# EAGLE schematic logmega (EAGLE 6.5.0)
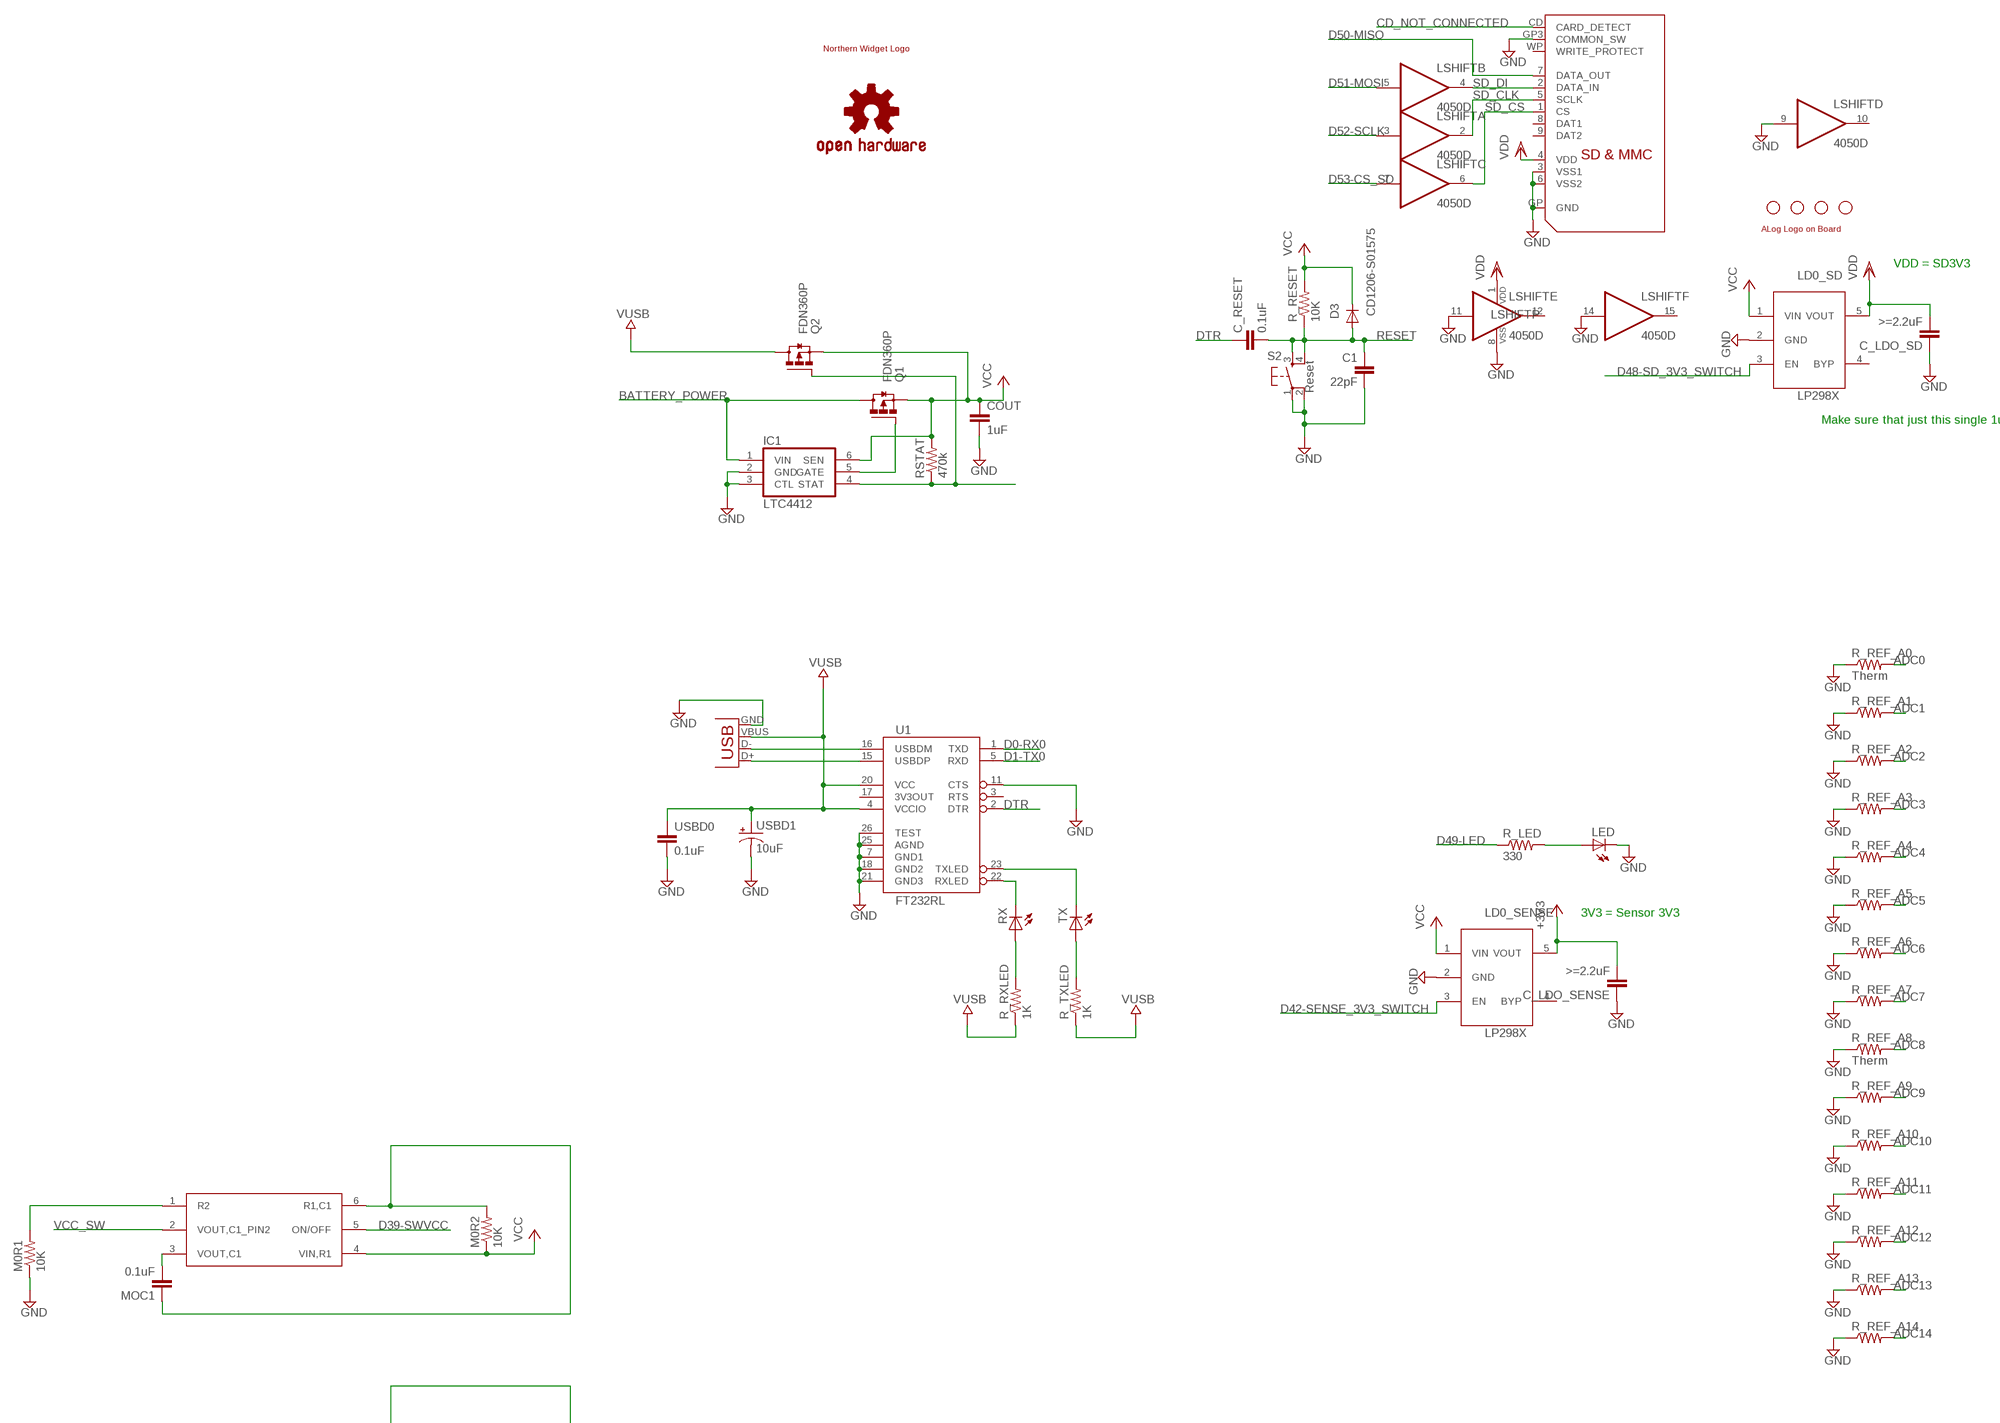
[diagram p0: schematic, sheet 1, part 1 of 3]
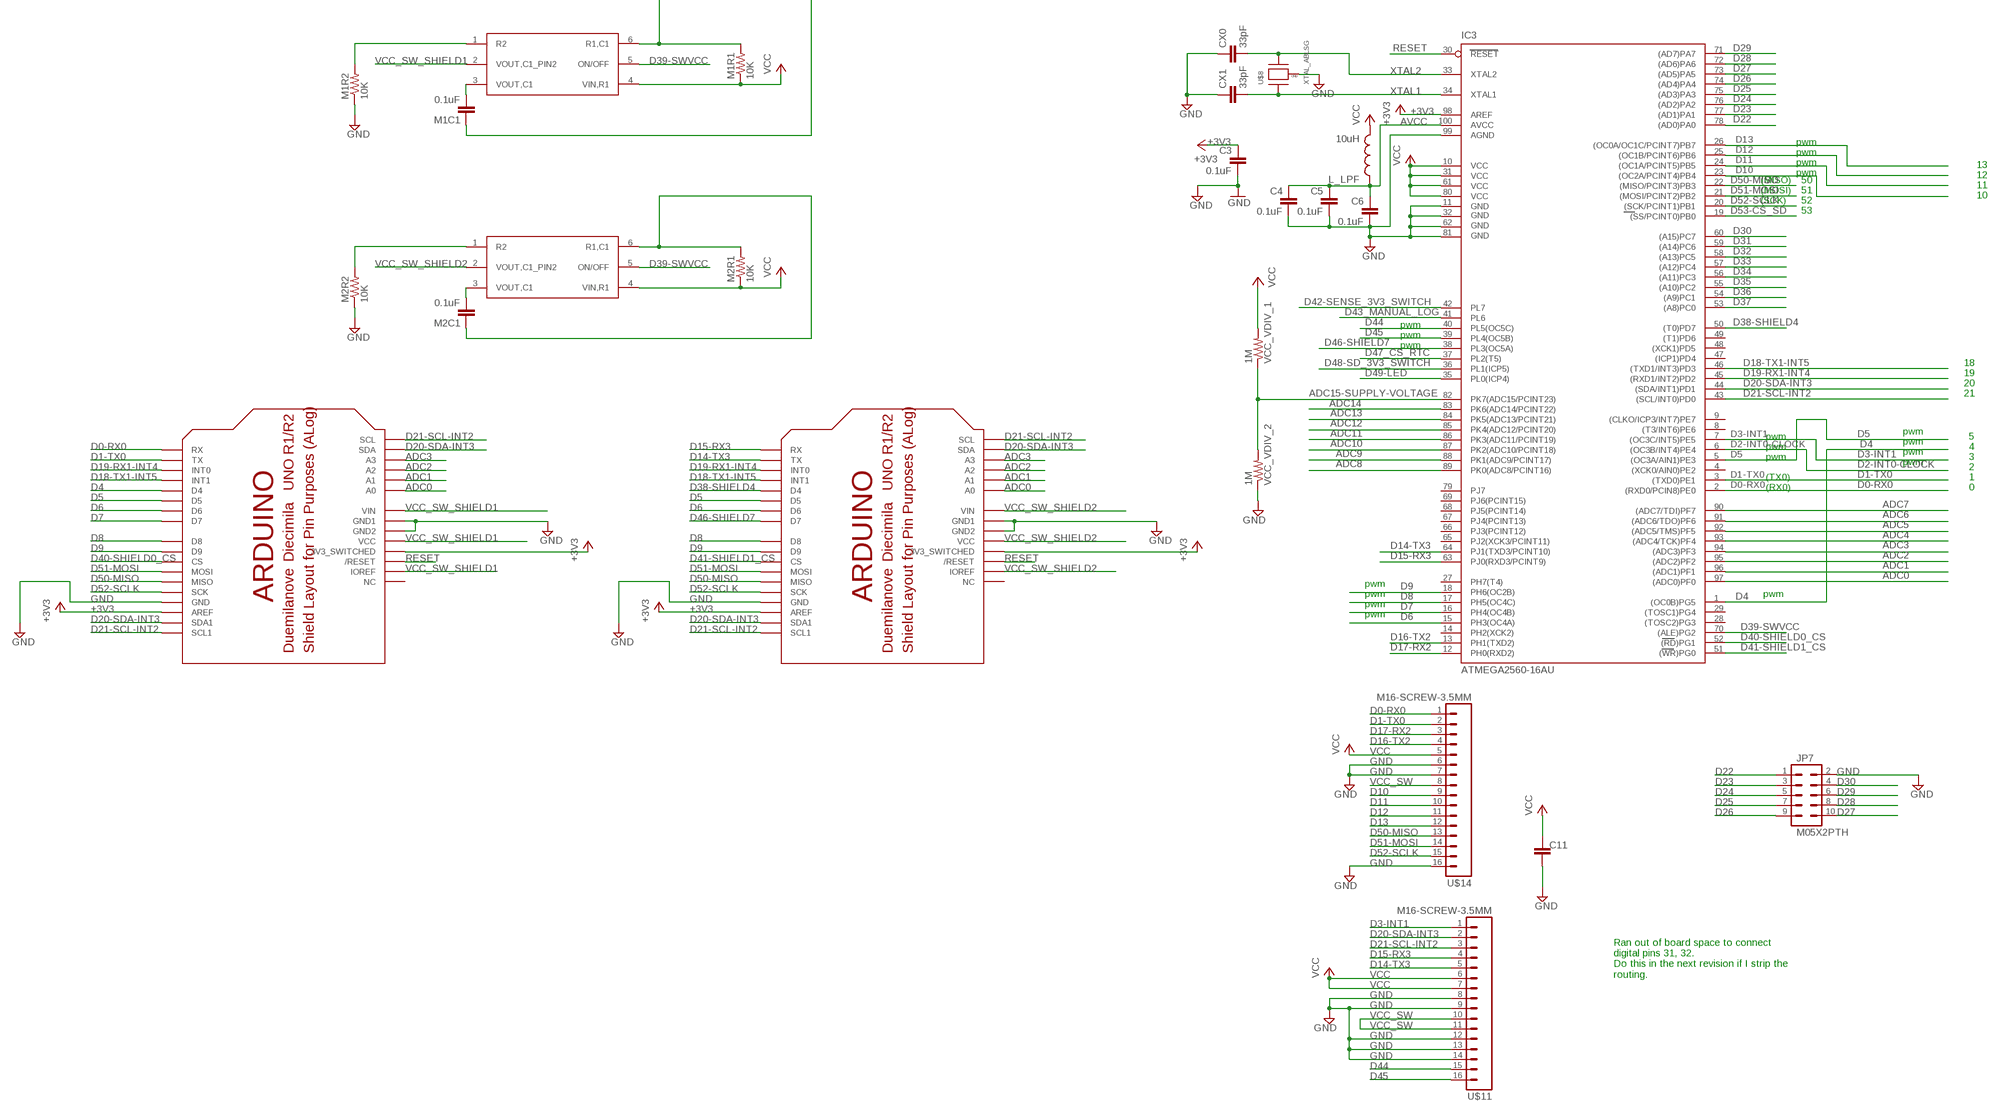
[diagram p1: schematic, sheet 1, part 2 of 3]
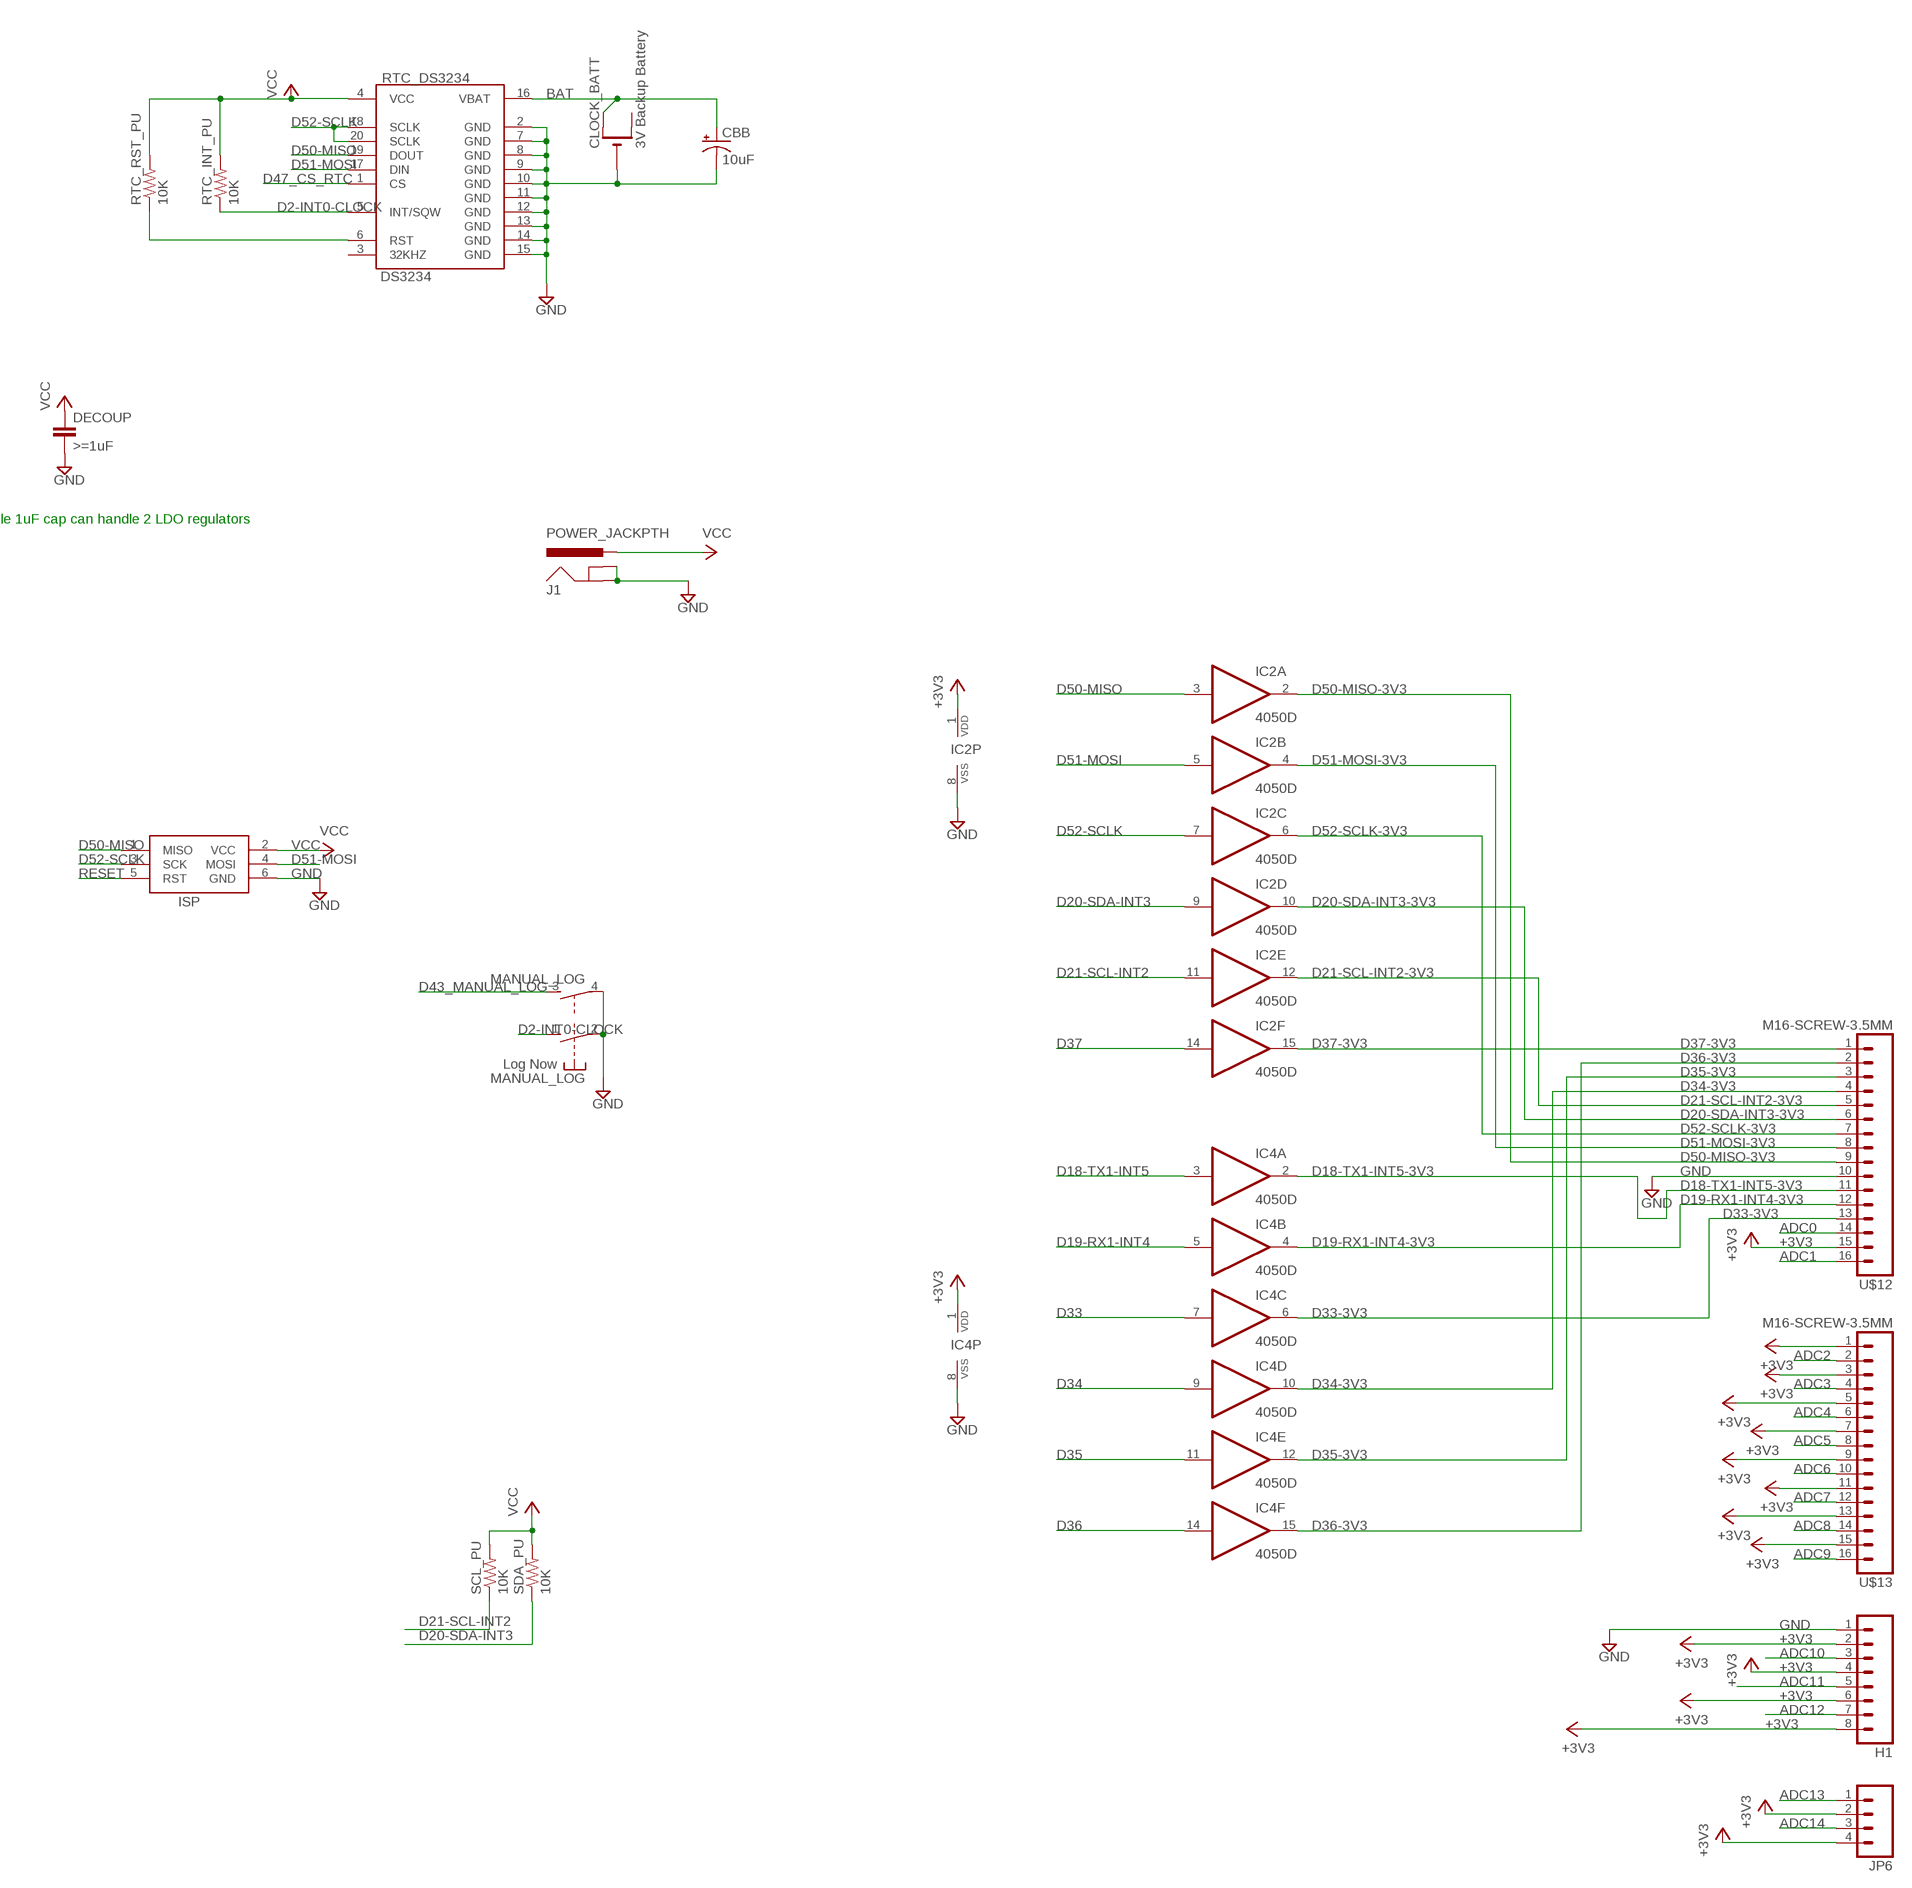
[diagram p2: schematic, sheet 1, part 3 of 3]

## Parts
C1  22pF  C-EU0603-RND  [C0603-ROUND]
C3  0.1uF  C-EU0603-RND  [C0603-ROUND]
C4  0.1uF  C-EU0603-RND  [C0603-ROUND]
C5  0.1uF  C-EU0603-RND  [C0603-ROUND]
C6  0.1uF  C-EU0603-RND  [C0603-ROUND]
C11  0.1uF  C-EU0603-RND  [C0603-ROUND]
C_LDO_SD  >=2.2uF  C-EUC0603  [C0603]
C_LDO_SENSE  >=2.2uF  C-EUC0603  [C0603]
C_RESET  0.1uF  C-EUC0603  [C0603]
CBB  10uF  CAP_POL1206  [EIA3216]
CLOCK_BATT  3V Backup Battery  CR2032  [CR2032-SMD]
COUT  1uF  C-EUC0603  [C0603-ROUND]
CX0  33pF  C-EUC0603  [C0603]
CX1  33pF  C-EUC0603  [C0603]
D3  CD1206-S01575  DIODE-MINIMELF  [MINIMELF]
DECOUP  >=1uF  C-EUC0603  [C0603]
H1  M083.5MM-8  [SCREWTERMINAL-3.5MM-8]
IC1  LTC4412  LTC4412ES6  [TSOT23-6]
IC2  4050D  [SO16]
IC3  ATMEGA2560-16AU  ATMEGA25602560-16AU  [TQFP100]
IC4  4050D  [SO16]
ISP  AVRISP-6  [AVRISP]
J1  POWER_JACKPTH  [POWER_JACK_PTH]
JP1  STAND-OFF  [STAND-OFF]
JP2  STAND-OFF  [STAND-OFF]
JP3  STAND-OFF  [STAND-OFF]
JP4  STAND-OFF  [STAND-OFF]
JP5  USB-B  USBPTH  [USB-B-PTH]
JP6  M04SCREW  [SCREWTERMINAL-3.5MM-4]
JP7  M05X2PTH  [AVR_ICSP]
L_LPF  10uH  INDUCTOR0805  [0805]
LD0_SD  LP2985  LP298XS  [SOT23-5L]
LD0_SENSE  LP2985  LP298XS  [SOT23-5L]
LED  LED3MM  [LED3MM]
LOGO1  OSHW-LOGOM  [OSHW-LOGO-M]
LSHIFT  4050D  [SO16]
M0/SW  FDG6342L  [SOT-363]
M0R1  10K  R-US_R0603  [R0603]
M0R2  10K  R-US_R0603  [R0603]
M1  FDG6342L  [SOT-363]
M1C1  0.1uF  C-EUC0603  [C0603]
M1R1  10K  R-US_R0603  [R0603]
M1R2  10K  R-US_R0603  [R0603]
M2  FDG6342L  [SOT-363]
M2C1  0.1uF  C-EUC0603  [C0603]
M2R1  10K  R-US_R0603  [R0603]
M2R2  10K  R-US_R0603  [R0603]
MANUAL_LOG  Log Now  PVA1  [PVA1F]
MOC1  0.1uF  C-EUC0603  [C0603]
Q1  FDN360P  [SUPER-SOT3]
Q2  FDN360P  [SUPER-SOT3]
R_LED  330  R-US_R0603  [R0603]
R_REF_A0  Therm  R-US_0207/10  [0207/10]
R_REF_A1  R-US_0207/10  [0207/10]
R_REF_A2  R-US_0207/10  [0207/10]
R_REF_A3  R-US_0207/10  [0207/10]
R_REF_A4  R-US_0207/10  [0207/10]
R_REF_A5  R-US_0207/10  [0207/10]
R_REF_A6  R-US_0207/10  [0207/10]
R_REF_A7  R-US_0207/10  [0207/10]
R_REF_A8  Therm  R-US_0207/10  [0207/10]
R_REF_A9  R-US_0207/10  [0207/10]
R_REF_A10  R-US_0207/10  [0207/10]
R_REF_A11  R-US_0207/10  [0207/10]
R_REF_A12  R-US_0207/10  [0207/10]
R_REF_A13  R-US_0207/10  [0207/10]
R_REF_A14  R-US_0207/10  [0207/10]
R_RESET  10K  R-US_R0603  [R0603]
R_RXLED  1K  R-US_R0603  [R0603]
R_TXLED  1K  R-US_R0603  [R0603]
RSTAT  470k  R-US_R0603  [R0603]
RTC_DS3234  DS3234  [DS3234]
RTC_INT_PU  10K  R-US_R0603  [R0603]
RTC_RST_PU  10K  R-US_R0603  [R0603]
RX  LED0603  [LED-0603]
S2  Reset  TAC_SWITCHPTH  [TACTILE-PTH]
SCL_PU  10K  R-US_R0603  [R0603]
SD  SDMMC06132  [06132]
SDA_PU  10K  R-US_R0603  [R0603]
TX  LED0603  [LED-0603]
U1  FT232RL  FT232RL-BASICSSOP  [SSOP28DB]
U$1  NWLOGO  [NWLOGO]
U$2  ALOG_LOGO_V1_5.5MM  [ALOG_LOGO_V1_SMALL]
U$7  ARDUINO_SHIELD_BIGLOG_2  [ARDUINO_SHIELD_PO_BL2]
U$8  XTAL_ABLSG  [AT49]
U$9  ARDUINO_SHIELD_BIGLOG_1  [ARDUINO_SHIELD_PO_BL1]
U$11  M16-SCREW-3.5MM  [M16-SCREW-3.5MM]
U$12  M16-SCREW-3.5MM  [M16-SCREW-3.5MM]
U$13  M16-SCREW-3.5MM  [M16-SCREW-3.5MM]
U$14  M16-SCREW-3.5MM  [M16-SCREW-3.5MM]
USBD0  0.1uF  C-EUC0603  [C0603]
USBD1  10uF  CAP_POL1206  [EIA3216]
VCC_VDIV_1  1M  R-US_R0603  [R0603]
VCC_VDIV_2  1M  R-US_R0603  [R0603]

## Nets
+3V3: C3.1 C_LDO_SENSE.2 H1.2 H1.4 H1.6 H1.8 IC2.1(P:VDD) IC3.98(AREF) IC4.1(P:VDD) JP6.2 JP6.4 LD0_SENSE.5(VOUT) U$7.3.3V(3V3_SWITCHED) U$7.AREF U$9.3.3V(3V3_SWITCHED) U$9.AREF U$12.15 U$13.1 U$13.3 U$13.5 U$13.7 U$13.9 U$13.11 U$13.13 U$13.15
ADC0: IC3.97((ADC0)PF0) R_REF_A0.2 U$7.A0 U$9.A0 U$12.14
ADC1: IC3.96((ADC1)PF1) R_REF_A1.2 U$7.A1 U$9.A1 U$12.16
ADC2: IC3.95((ADC2)PF2) R_REF_A2.2 U$7.A2 U$9.A2 U$13.2
ADC3: IC3.94((ADC3)PF3) R_REF_A3.2 U$7.A3 U$9.A3 U$13.4
ADC4: IC3.93((ADC4/TCK)PF4) R_REF_A4.2 U$13.6
ADC5: IC3.92((ADC5/TMS)PF5) R_REF_A5.2 U$13.8
ADC6: IC3.91((ADC6/TDO)PF6) R_REF_A6.2 U$13.10
ADC7: IC3.90((ADC7/TDI)PF7) R_REF_A7.2 U$13.12
ADC8: IC3.89(PK0(ADC8/PCINT16)) R_REF_A8.2 U$13.14
ADC9: IC3.88(PK1(ADC9/PCINT17)) R_REF_A9.2 U$13.16
ADC10: H1.3 IC3.87(PK2(ADC10/PCINT18)) R_REF_A10.2
ADC11: H1.5 IC3.86(PK3(ADC11/PCINT19)) R_REF_A11.2
ADC12: H1.7 IC3.85(PK4(ADC12/PCINT20)) R_REF_A12.2
ADC13: IC3.84(PK5(ADC13/PCINT21)) JP6.1 R_REF_A13.2
ADC14: IC3.83(PK6(ADC14/PCINT22)) JP6.3 R_REF_A14.2
ADC15-SUPPLY-VOLTAGE: IC3.82(PK7(ADC15/PCINT23)) VCC_VDIV_1.1 VCC_VDIV_2.2
AVCC: C4.1 C5.1 C6.1 IC3.100(AVCC) L_LPF.1
BAT: CBB.A(+) CLOCK_BATT.+$1(+) RTC_DS3234.16(VBAT)
BATTERY_POWER: IC1.1(VIN) Q1.3(D)
CD_NOT_CONNECTED: SD.CD(CARD_DETECT)
D0-RX0: IC3.2((RXD0/PCIN8)PE0) U1.1(TXD) U$9.RX U$14.1
D1-TX0: IC3.3((TXD0)PE1) U1.5(RXD) U$9.TX U$14.2
D2-INT0-CLOCK: IC3.6((OC3B/INT4)PE4) MANUAL_LOG.1(1:S) RTC_DS3234.5(INT/SQW) RTC_INT_PU.1
D3-INT1: IC3.7((OC3C/INT5)PE5) U$11.1
D4: IC3.1((OC0B)PG5) U$9.D4
D5: IC3.5((OC3A/AIN1)PE3) U$7.D5 U$9.D5
D6: IC3.15(PH3(OC4A)) U$7.D6 U$9.D6
D7: IC3.16(PH4(OC4B)) U$9.D7
D8: IC3.17(PH5(OC4C)) U$7.D8 U$9.D8
D9: IC3.18(PH6(OC2B)) U$7.D9 U$9.D9
D10: IC3.23((OC2A/PCINT4)PB4) U$14.9
D11: IC3.24((OC1A/PCINT5)PB5) U$14.10
D12: IC3.25((OC1B/PCINT6)PB6) U$14.11
D13: IC3.26((OC0A/OC1C/PCINT7)PB7) U$14.12
D14-TX3: IC3.64(PJ1(TXD3/PCINT10)) U$7.TX U$11.5
D15-RX3: IC3.63(PJ0(RXD3/PCINT9)) U$7.RX U$11.4
D16-TX2: IC3.13(PH1(TXD2)) U$14.4
D17-RX2: IC3.12(PH0(RXD2)) U$14.3
D18-TX1-INT5: IC3.46((TXD1/INT3)PD3) IC4.3(A:I) U$7.D3(INT1) U$9.D3(INT1)
D18-TX1-INT5-3V3: IC4.2(A:O) U$12.11
D19-RX1-INT4: IC3.45((RXD1/INT2)PD2) IC4.5(B:I) U$7.D2(INT0) U$9.D2(INT0)
D19-RX1-INT4-3V3: IC4.4(B:O) U$12.12
D20-SDA-INT3: IC2.9(D:I) IC3.44((SDA/INT1)PD1) SDA_PU.1 U$7.A4(SDA) U$7.SDA(SDA1) U$9.A4(SDA) U$9.SDA(SDA1) U$11.2
D20-SDA-INT3-3V3: IC2.10(D:O) U$12.6
D21-SCL-INT2: IC2.11(E:I) IC3.43((SCL/INT0)PD0) SCL_PU.1 U$7.A5(SCL) U$7.SCL(SCL1) U$9.A5(SCL) U$9.SCL(SCL1) U$11.3
D21-SCL-INT2-3V3: IC2.12(E:O) U$12.5
D22: IC3.78((AD0)PA0) JP7.1
D23: IC3.77((AD1)PA1) JP7.3
D24: IC3.76((AD2)PA2) JP7.5
D25: IC3.75((AD3)PA3) JP7.7
D26: IC3.74((AD4)PA4) JP7.9
D27: IC3.73((AD5)PA5) JP7.10
D28: IC3.72((AD6)PA6) JP7.8
D29: IC3.71((AD7)PA7) JP7.6
D30: IC3.60((A15)PC7) JP7.4
D31: IC3.59((A14)PC6)
D32: IC3.58((A13)PC5)
D33: IC3.57((A12)PC4) IC4.7(C:I)
D33-3V3: IC4.6(C:O) U$12.13
D34: IC3.56((A11)PC3) IC4.9(D:I)
D34-3V3: IC4.10(D:O) U$12.4
D35: IC3.55((A10)PC2) IC4.11(E:I)
D35-3V3: IC4.12(E:O) U$12.3
D36: IC3.54((A9)PC1) IC4.14(F:I)
D36-3V3: IC4.15(F:O) U$12.2
D37: IC2.14(F:I) IC3.53((A8)PC0)
D37-3V3: IC2.15(F:O) U$12.1
D38-SHIELD4: IC3.50((T0)PD7) U$7.D4
D39-SWVCC: IC3.70((ALE)PG2) M0/SW.5(ON/OFF) M1.5(ON/OFF) M2.5(ON/OFF)
D40-SHIELD0_CS: IC3.52((RD)PG1) U$9.D10(CS)
D41-SHIELD1_CS: IC3.51((WR)PG0) U$7.D10(CS)
D42-SENSE_3V3_SWITCH: IC3.42(PL7) LD0_SENSE.3(EN)
D43_MANUAL_LOG: IC3.41(PL6) MANUAL_LOG.3(2:S)
D44: IC3.40(PL5(OC5C)) U$11.15
D45: IC3.39(PL4(OC5B)) U$11.16
D46-SHIELD7: IC3.38(PL3(OC5A)) U$7.D7
D47_CS_RTC: IC3.37(PL2(T5)) RTC_DS3234.1(CS)
D48-SD_3V3_SWITCH: IC3.36(PL1(ICP5)) LD0_SD.3(EN)
D49-LED: IC3.35(PL0(ICP4)) R_LED.1
D50-MISO: IC2.3(A:I) IC3.22((MISO/PCINT3)PB3) ISP.1(MISO) RTC_DS3234.19(DOUT) SD.7(DATA_OUT) U$7.D12(MISO) U$9.D12(MISO) U$14.13
D50-MISO-3V3: IC2.2(A:O) U$12.9
D51-MOSI: IC2.5(B:I) IC3.21((MOSI/PCINT2)PB2) ISP.4(MOSI) LSHIFT.5(B:I) RTC_DS3234.17(DIN) U$7.D11(MOSI) U$9.D11(MOSI) U$14.14
D51-MOSI-3V3: IC2.4(B:O) U$12.8
D52-SCLK: IC2.7(C:I) IC3.20((SCK/PCINT1)PB1) ISP.3(SCK) LSHIFT.3(A:I) RTC_DS3234.18(SCLK) RTC_DS3234.20(SCLK) U$7.D13(SCK) U$9.D13(SCK) U$14.15
D52-SCLK-3V3: IC2.6(C:O) U$12.7
D53-CS_SD: IC3.19((SS/PCINT0)PB0) LSHIFT.7(C:I)
DTR: C_RESET.1 U1.2(DTR)
GND [gnd]: C1.2 C3.2 C4.2 C5.2 C6.2 C11.1 C_LDO_SD.1 C_LDO_SENSE.1 CBB.C(-) CLOCK_BATT.- COUT.2 CX0.1 CX1.1 DECOUP.2 H1.1 IC1.2(GND) IC1.3(CTL) IC2.8(P:VSS) IC3.11(GND) IC3.32(GND1) IC3.62(GND2) IC3.81(GND3) IC3.99(AGND) IC4.8(P:VSS) ISP.6(GND) J1.GND J1.GNDBREAK JP5.GND JP7.2 LD0_SD.2(GND) LD0_SENSE.2(GND) LED.K(C) LSHIFT.8(P:VSS) LSHIFT.9(D:I) LSHIFT.11(E:I) LSHIFT.14(F:I) M0R1.1 M1R2.1 M2R2.1 MANUAL_LOG.2(1:P) MANUAL_LOG.4(2:P) R_REF_A0.1 R_REF_A1.1 R_REF_A2.1 R_REF_A3.1 R_REF_A4.1 R_REF_A5.1 R_REF_A6.1 R_REF_A7.1 R_REF_A8.1 R_REF_A9.1 R_REF_A10.1 R_REF_A11.1 R_REF_A12.1 R_REF_A13.1 R_REF_A14.1 RTC_DS3234.2(GND) RTC_DS3234.7(GND) RTC_DS3234.8(GND) RTC_DS3234.9(GND) RTC_DS3234.10(GND) RTC_DS3234.11(GND) RTC_DS3234.12(GND) RTC_DS3234.13(GND) RTC_DS3234.14(GND) RTC_DS3234.15(GND) S2.1 S2.2 SD.3(VSS1) SD.6(VSS2) SD.GP3(COMMON_SW) SD.GP(GND) U1.7(GND1) U1.11(CTS) U1.18(GND2) U1.21(GND3) U1.25(AGND) U1.26(TEST) U$7.GND@0(GND) U$7.GND@1(GND1) U$7.GND@2(GND2) U$8.GND U$9.GND@0(GND) U$9.GND@1(GND1) U$9.GND@2(GND2) U$11.8 U$11.9 U$11.12 U$11.13 U$11.14 U$12.10 U$14.6 U$14.7 U$14.16 USBD0.2 USBD1.C(-) VCC_VDIV_2.1
LED+: LED.A R_LED.2
N$1: RX.C U1.22(RXLED)
N$2: JP5.D+ U1.15(USBDP)
N$3: JP5.D- U1.16(USBDM)
N$4: TX.C U1.23(TXLED)
N$5: R_RXLED.2 RX.A
N$6: R_TXLED.2 TX.A
N$7: IC1.4(STAT) Q2.1(G) RSTAT.1
N$8: IC1.5(GATE) Q1.1(G)
N$9: RTC_DS3234.6(RST) RTC_RST_PU.1
N$10: M0/SW.3(VOUT,C1) MOC1.2
N$12: M1.1(R2) M1R2.2
N$13: M0/SW.1(R2) M0R1.2
N$14: M0/SW.6(R1,C1) M0R2.2 MOC1.1
N$15: M1.6(R1,C1) M1C1.1 M1R1.2
N$16: M1.3(VOUT,C1) M1C1.2
N$17: M2.1(R2) M2R2.2
N$18: M2.6(R1,C1) M2C1.1 M2R1.2
N$19: M2.3(VOUT,C1) M2C1.2
RESET: C1.1 C_RESET.2 D3.A IC3.30(RESET) ISP.5(RST) R_RESET.1 S2.3 S2.4 U$7.RES(/RESET) U$9.RES(/RESET)
SD_CLK: LSHIFT.2(A:O) SD.5(SCLK)
SD_CS: LSHIFT.6(C:O) SD.1(CS)
SD_DI: LSHIFT.4(B:O) SD.2(DATA_IN)
VCC [power]: C11.2 COUT.1 D3.C DECOUP.1 IC1.6(SEN) IC3.10(VCC) IC3.31(VCC1) IC3.61(VCC2) IC3.80(VCC3) ISP.2(VCC) J1.PWR L_LPF.2 LD0_SD.1(VIN) LD0_SENSE.1(VIN) M0/SW.4(VIN,R1) M0R2.1 M1.4(VIN,R1) M1R1.1 M2.4(VIN,R1) M2R1.1 Q1.2(S) Q2.2(S) R_RESET.2 RSTAT.2 RTC_DS3234.4(VCC) RTC_INT_PU.2 RTC_RST_PU.2 SCL_PU.2 SDA_PU.2 U$11.6 U$11.7 U$14.5 VCC_VDIV_1.2
VCC_SW: M0/SW.2(VOUT,C1_PIN2) U$11.10 U$11.11 U$14.8
VCC_SW_SHIELD1 [pwr sw]: M1.2(VOUT,C1_PIN2) U$9.5V(VCC) U$9.IOREF U$9.VIN
VCC_SW_SHIELD2 [pwr sw]: M2.2(VOUT,C1_PIN2) U$7.5V(VCC) U$7.IOREF U$7.VIN
VDD: C_LDO_SD.2 LD0_SD.5(VOUT) LSHIFT.1(P:VDD) SD.4(VDD)
VUSB [pwr sw]: JP5.VBUS Q2.3(D) R_RXLED.1 R_TXLED.1 U1.4(VCCIO) U1.20(VCC) USBD0.1 USBD1.A(+)
XTAL1: CX1.2 IC3.34(XTAL1) U$8.IO1
XTAL2: CX0.2 IC3.33(XTAL2) U$8.IO2
Unconnected: CLOCK_BATT.+$2(+1) IC3.4((XCK0/AIN0)PE2) IC3.8((T3/INT6)PE6) IC3.9((CLKO/ICP3/INT7)PE7) IC3.14(PH2(XCK2)) IC3.27(PH7(T4)) IC3.28((TOSC2)PG3) IC3.29((TOSC1)PG4) IC3.47((ICP1)PD4) IC3.48((XCK1)PD5) IC3.49((T1)PD6) IC3.65(PJ2(XCK3/PCINT11)) IC3.66(PJ3(PCINT12)) IC3.67(PJ4(PCINT13)) IC3.68(PJ5(PCINT14)) IC3.69(PJ6(PCINT15)) IC3.79(PJ7) LD0_SD.4(BYP) LD0_SENSE.4(BYP) LSHIFT.10(D:O) LSHIFT.12(E:O) LSHIFT.15(F:O) RTC_DS3234.3(32KHZ) SD.8(DAT1) SD.9(DAT2) SD.WP(WRITE_PROTECT) U1.3(RTS) U1.17(3V3OUT) U$7.NC U$9.NC

## Notes on the sheet
- VDD = SD3V3
- Make sure that just this single 1uF cap can handle 2 LDO regulators
- 3V3 = Sensor 3V3
- pwm
- pwm
- pwm | 13
- pwm | 12
- (MISO) | 50
- 11
- (MOSI) | 51
- 10
- (SCK) | 52
- 53
- pwm
- pwm
- pwm
- 18
- 19
- 20
- 21
- pwm
- pwm | 5
- pwm
- pwm | 4
- pwm
- pwm | 3
- pwm
- 2
- (TX0) | 1
- (RX0) | 0
- pwm
- pwm | pwm
- pwm
- pwm
- Ran out of board space to connect
  digital pins 31, 32.
  Do this in the next revision if I strip the
  routing.

## Library data of the parts
C1 C3-C6 C11 COUT = SmartPrj:C-EU: CAPACITOR, European symbol
C_LDO_SD C_LDO_SENSE C_RESET CX0 CX1 DECOUP M1C1 M2C1 MOC1 USBD0 = resistor:C-EU: CAPACITOR, European symbol
CBB USBD1 = SparkFun:CAP_POL: Capacitor Polarized These are standard SMD and PTH capacitors. Normally 10uF, 47uF, and 100uF in electrolytic and tantalum varieties. Always verify the external diameter of the through hole cap, it varies with capacity, voltage, and manufacturer. The EIA devices should be standard.
CLOCK_BATT = awickert:CR2032: Adafruit's CR2032 except with a keepout. Received a board with beveled bottom below the circle of the footprint, and want to avoid traces touching battery.
D3 = diode:DIODE-: DIODE
H1 = SparkFun:M08: Header 8 Standard 8-pin 0.1" header. Use with straight break away headers (SKU : PRT-00116), right angle break away headers (PRT-00553), swiss pins (PRT-00743), machine pins (PRT-00117), and female headers (PRT-00115).
IC1 = awickert:LTC4412*: Low Loss PowerPath Controller
IC2 IC4 LSHIFT = 40xx:4050: Hex non-inverting BUFFER
IC3 = SmartPrj:ATMEGA2560: MICROCONTROLLER 64/128/256 Kbytes FLASH 4 Kbytes EEPROM 8 Kbytes SRAM 86 General Purpose I/O pins 12-channels16-bit PWM 4 x Serial USARTs 16-channels 10-bit A/D
ISP = adafruit:AVRISP: AVR ISP HEADER Standard 6 pin header for AVR programming
J1 = SparkFun:POWER_JACK: Power Jack This is the standard 5.5mm barrel jack for power. The PTH is the most common, proven, reliable, footprint. All others are experimental. The Slot footprint only works if the mill layer is transmitted to the PCB fab house so be warned. Spark Fun Electronics SKU : PRT-00119. Mating wall wart : TOL-00298 (and others)
JP1-JP4 = SparkFun:STAND-OFF: Stand Off This is the mechanical footprint for a #4 phillips button head screw. Use the keepout ring to avoid running the screw head into surrounding components. SKU : PRT-00447
JP5 = SparkFun-Connectors:USB: USB Connectors USB-B-PTH is fully proven SKU : PRT-00139/CONN-08278 USB-miniB is fully proven SKU : PRT-00587 USB-A-PCB is untested. USB-A-H is throughly reviewed, but untested. Spark Fun Electronics SKU : PRT-00437 USB-B-SMT is throughly reviewed, but untested. Needs silkscreen touching up. USB-A-S has not been used/tested USB-MB-H has not been used/tested USB-MICROB has been used. CONN-09505; PROD_ID: CONN-08278
JP6 = SparkFun-Connectors:M04: Header 4 Standard 4-pin 0.1" header. Use with straight break away headers (SKU : PRT-00116), right angle break away headers (PRT-00553), swiss pins (PRT-00743), machine pins (PRT-00117), and female headers (PRT-00115). Molex polarized connector foot print use with SKU : PRT-08231 with associated crimp pins and housings. 1MM SMD Version SKU: PRT-10208
JP7 = SparkFun-Connectors:M05X2: Header 5x2 Standard 10-pin dual row 0.1" header. Commonly used with AVR-ISP. Use with Spark Fun Electronics SKU: PRT-00778
L_LPF = SparkFun:INDUCTOR: Inductors Basic Inductor/Choke - 0603 and 1206. Footprints are not proven and vary greatly between part numbers.
LD0_SD LD0_SENSE = adafruit:LP298X
LED = SparkFun:LED: LEDs Standard schematic elements and footprints for 5mm, 3mm, 1206, and 0603 sized LEDs. 5mm - Spark Fun Electronics SKU : COM-00529 (and others)
LOGO1 = SparkFun-Aesthetics:OSHW-LOGO: Open Source Hardware Logo This logo indicates the piece of hardware it is found on incorporates a OSHW license and/or adheres to the definition of open source hardware found here: http://freedomdefined.org/OSHW
M0/SW M1 M2 = awickert:FDG6342L
M0R1 M0R2 M1R1 M1R2 M2R1 M2R2 R_LED R_RESET R_RXLED R_TXLED RSTAT RTC_INT_PU RTC_RST_PU SCL_PU SDA_PU VCC_VDIV_1 VCC_VDIV_2 = rcl:R-US_: RESISTOR, American symbol
MANUAL_LOG = switch-misc:PVA1: ITT SWITCH
Q1 Q2 = transistor-power:FDN360P: Single P-Channel, PowerTrench (R) MOSFET Source: http://www.fairchildsemi.com/ds/FD/FDN360P.pdf
R_REF_A0 R_REF_A1-R_REF_A14 = resistor:R-US_: RESISTOR, American symbol
RTC_DS3234 = SparkFun:DS3234: DS3234 Real Time Clock
RX TX = SparkFun-LED:LED: LEDs Standard schematic elements and footprints for 5mm, 3mm, 1206, and 0603 sized LEDs. 5mm - Spark Fun Electronics SKU : COM-00529 (and others)
S2 = SparkFun-Electromechanical:TAC_SWITCH: Momentary Switch Button commonly used for reset or general input. Spark Fun Electronics SKU : COM-00097 SMT- SWCH-08247
SD = adafruit:SDMMC: SD MMC Card holder 4UCON part #06132 - easy to solder
U1 = SparkFun-DigitalIC:FT232RL-BASIC: USB UART This is the simplified version of the FT232RL unit. Only what you need, nothing you don't. Spark Fun Electronics SKU : COM-00650
U$1 = awickert:NWLOGO
U$2 = awickert:ALOG_LOGO_V1_5.5MM
U$7 = awickert:ARDUINO_SHIELD_BIGLOG_2
U$8 = awickert:XTAL_ABLSG: A nice xtal
U$9 = awickert:ARDUINO_SHIELD_BIGLOG_1
U$11-U$14 = awickert:M16-SCREW-3.5MM

## Net classes
0 default: width 0.152 mm, drill 0.5 mm, clearance 0.203 mm
1 power: width 0.61 mm, drill 1 mm, clearance 0.203 mm
2 gnd: width 0.61 mm, drill 1 mm, clearance 0.203 mm
3 pwr sw: width 0.406 mm, drill 0.8 mm, clearance 0.203 mm